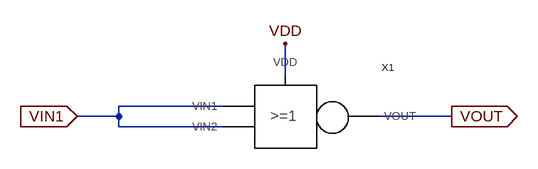
[diagram p0: schematic dimanot.asc]
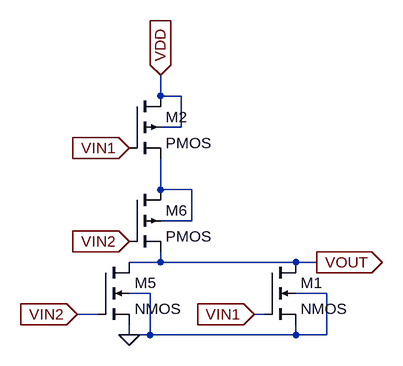
[diagram p1: sub-circuit dimanor.asc]
dimanot.asc, the LTspice schematic file:
Version 4
SHEET 1 880 680
WIRE 272 112 272 64
WIRE 176 160 16 160
WIRE 16 176 16 160
WIRE 16 176 -48 176
WIRE 528 176 416 176
WIRE 16 192 16 176
WIRE 176 192 16 192
FLAG -48 176 VIN1
IOPIN -48 176 In
FLAG 272 64 VDD
FLAG 528 176 VOUT
IOPIN 528 176 Out
SYMBOL dimanor 272 160 R0
SYMATTR InstName X1

dimanor.asc, the sub-circuit schematic file:
Version 4
SHEET 1 880 680
WIRE 464 64 464 32
WIRE 496 64 464 64
WIRE 496 112 496 64
WIRE 496 112 464 112
WIRE 464 208 464 160
WIRE 512 208 464 208
WIRE 512 256 512 208
WIRE 512 256 464 256
WIRE 464 320 464 304
WIRE 464 320 416 320
WIRE 672 320 464 320
WIRE 704 320 672 320
WIRE 448 368 416 368
WIRE 720 368 672 368
WIRE 368 400 336 400
WIRE 624 400 608 400
WIRE 416 432 416 416
WIRE 448 432 448 368
WIRE 448 432 416 432
WIRE 672 432 672 416
WIRE 672 432 448 432
WIRE 720 432 720 368
WIRE 720 432 672 432
FLAG 416 144 VIN1
IOPIN 416 144 In
FLAG 416 288 VIN2
IOPIN 416 288 In
FLAG 608 400 VIN1
IOPIN 608 400 In
FLAG 336 400 VIN2
IOPIN 336 400 In
FLAG 416 432 0
FLAG 464 32 VDD
IOPIN 464 32 In
FLAG 704 320 VOUT
IOPIN 704 320 Out
SYMBOL nmos4 368 320 R0
SYMATTR InstName M5
SYMATTR Value2 l=90n w=200n
SYMBOL nmos4 624 320 R0
SYMATTR InstName M1
SYMATTR Value2 l=90n w=200n
SYMBOL pmos4 416 64 R0
SYMATTR InstName M2
SYMATTR Value2 l=90n w=400n
SYMBOL pmos4 416 208 R0
SYMATTR InstName M6
SYMATTR Value2 l=90n w=400n

The netlist it stands for:
* dimanot.asc
XX1 VIN1 VIN1 VDD VOUT dimanor

* block symbol definitions
.subckt dimanor VIN1 VIN2 VDD VOUT
M5 VOUT VIN2 0 0 NMOS l=90n w=200n
M1 VOUT VIN1 0 0 NMOS l=90n w=200n
M2 VDD VIN1 N001 VDD PMOS l=90n w=400n
M6 N001 VIN2 VOUT N001 PMOS l=90n w=400n
.ends dimanor

.model NMOS NMOS
.model PMOS PMOS
.lib standard.mos
.backanno
.end